# Altium schematic sheet MY_beamControl_R_组件电源分配.SchDoc
size A3
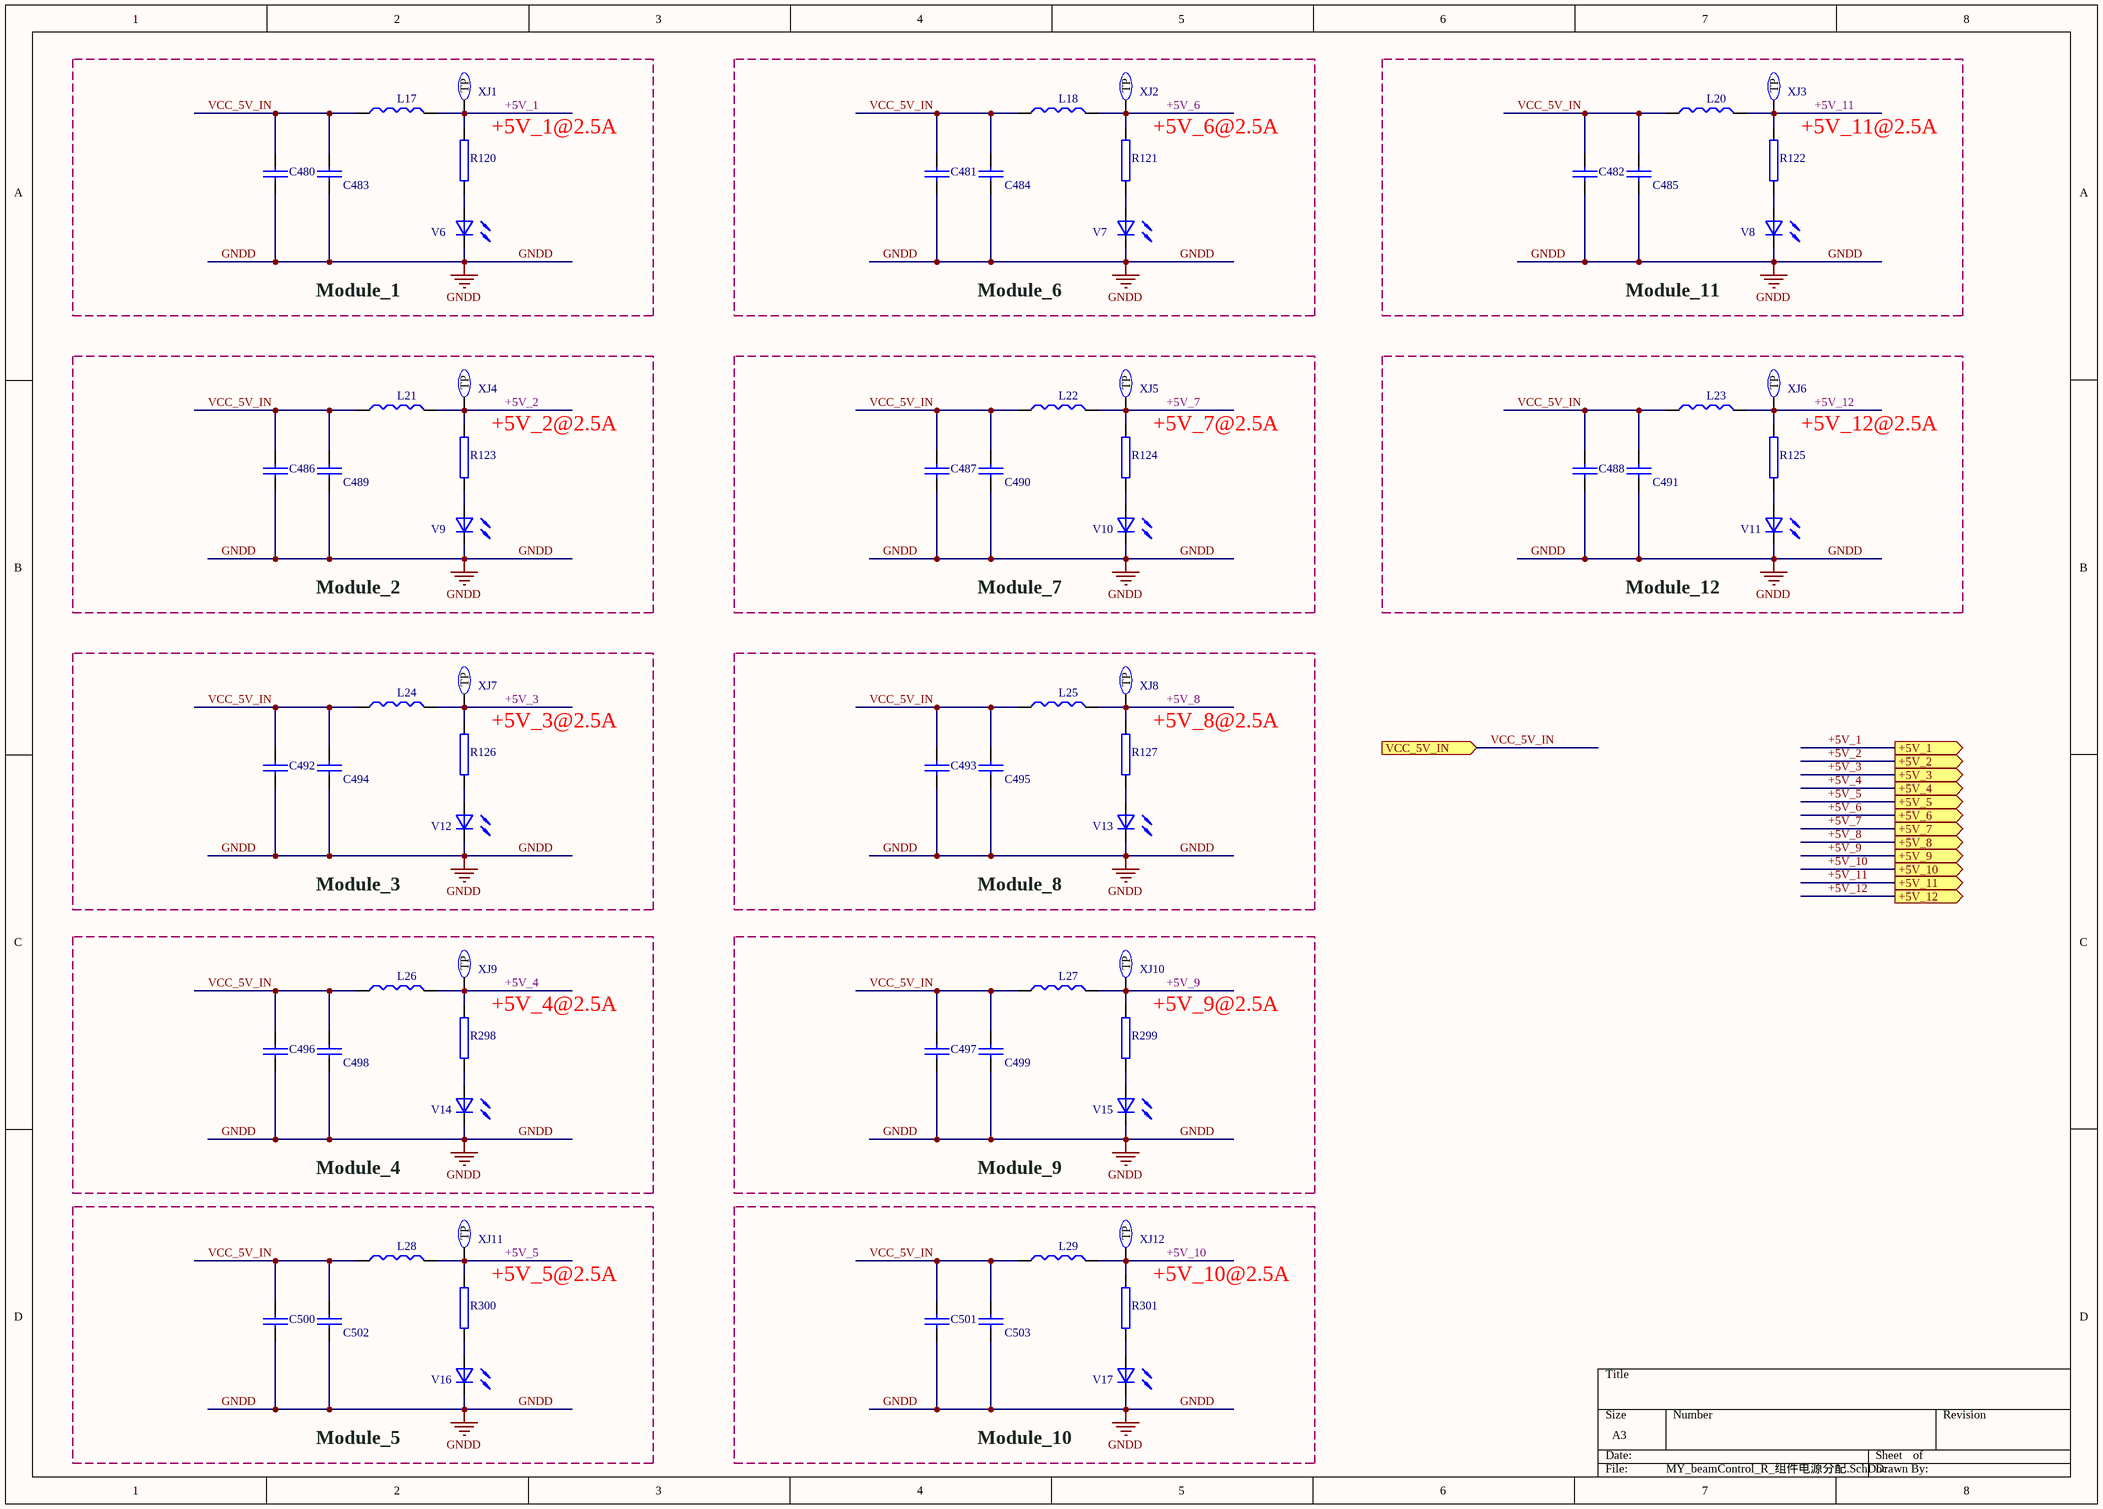
[diagram p0: MY_beamControl_R_组件电源分配.SchDoc]

## Parts
C480  C0805-4.7uF/16V  [0805]  (value not drawn)
C481  C0805-4.7uF/16V  [0805]  (value not drawn)
C482  C0805-4.7uF/16V  [0805]  (value not drawn)
C483  CT41-0402-2X1-16V-104(0.1μF)  [c0402]  (value not drawn)
C484  CT41-0402-2X1-16V-104(0.1μF)  [c0402]  (value not drawn)
C485  CT41-0402-2X1-16V-104(0.1μF)  [c0402]  (value not drawn)
C486  C0805-4.7uF/16V  [0805]  (value not drawn)
C487  C0805-4.7uF/16V  [0805]  (value not drawn)
C488  C0805-4.7uF/16V  [C0805]  (value not drawn)
C489  CT41-0402-2X1-16V-104(0.1μF)  [c0402]  (value not drawn)
C490  CT41-0402-2X1-16V-104(0.1μF)  [c0402]  (value not drawn)
C491  CT41-0402-2X1-16V-104(0.1μF)  [c0402]  (value not drawn)
C492  C0805-4.7uF/16V  [0805]  (value not drawn)
C493  C0805-4.7uF/16V  [0805]  (value not drawn)
C494  CT41-0402-2X1-16V-104(0.1μF)  [c0402]  (value not drawn)
C495  CT41-0402-2X1-16V-104(0.1μF)  [c0402]  (value not drawn)
C496  C0805-4.7uF/16V  [0805]  (value not drawn)
C497  C0805-4.7uF/16V  [0805]  (value not drawn)
C498  CT41-0402-2X1-16V-104(0.1μF)  [c0402]  (value not drawn)
C499  CT41-0402-2X1-16V-104(0.1μF)  [c0402]  (value not drawn)
C500  C0805-4.7uF/16V  [0805]  (value not drawn)
C501  C0805-4.7uF/16V  [0805]  (value not drawn)
C502  CT41-0402-2X1-16V-104(0.1μF)  [c0402]  (value not drawn)
C503  CT41-0402-2X1-16V-104(0.1μF)  [c0402]  (value not drawn)
L17  MPZ2012S101A  [R0805]  (value not drawn)
L18  MPZ2012S101A  [R0805]  (value not drawn)
L20  MPZ2012S101A  [R0805]  (value not drawn)
L21  MPZ2012S101A  [R0805]  (value not drawn)
L22  MPZ2012S101A  [R0805]  (value not drawn)
L23  MPZ2012S101A  [R0805]  (value not drawn)
L24  MPZ2012S101A  [R0805]  (value not drawn)
L25  MPZ2012S101A  [R0805]  (value not drawn)
L26  MPZ2012S101A  [R0805]  (value not drawn)
L27  MPZ2012S101A  [R0805]  (value not drawn)
L28  MPZ2012S101A  [R0805]  (value not drawn)
L29  MPZ2012S101A  [R0805]  (value not drawn)
R120  0805-512(5.1K)  [0805]  (value not drawn)
R121  0805-512(5.1K)  [0805]  (value not drawn)
R122  0805-512(5.1K)  [0805]  (value not drawn)
R123  0805-512(5.1K)  [0805]  (value not drawn)
R124  0805-512(5.1K)  [0805]  (value not drawn)
R125  0805-512(5.1K)  [0805]  (value not drawn)
R126  0805-512(5.1K)  [0805]  (value not drawn)
R127  0805-512(5.1K)  [0805]  (value not drawn)
R298  0805-512(5.1K)  [0805]  (value not drawn)
R299  0805-512(5.1K)  [0805]  (value not drawn)
R300  0805-512(5.1K)  [0805]  (value not drawn)
R301  0805-512(5.1K)  [0805]  (value not drawn)
V6  LED0603-GREEN  [LED-R0603]  (value not drawn)
V7  LED0603-GREEN  [LED-R0603]  (value not drawn)
V8  LED0603-GREEN  [LED-R0603]  (value not drawn)
V9  LED0603-GREEN  [LED-R0603]  (value not drawn)
V10  LED0603-GREEN  [LED-R0603]  (value not drawn)
V11  LED0603-GREEN  [LED-R0603]  (value not drawn)
V12  LED0603-GREEN  [LED-R0603]  (value not drawn)
V13  LED0603-GREEN  [LED-R0603]  (value not drawn)
V14  LED0603-GREEN  [LED-R0603]  (value not drawn)
V15  LED0603-GREEN  [LED-R0603]  (value not drawn)
V16  LED0603-GREEN  [LED-R0603]  (value not drawn)
V17  LED0603-GREEN  [LED-R0603]  (value not drawn)
XJ1  Test Point  [TP3]  (value not drawn)
XJ2  Test Point  [TP3]  (value not drawn)
XJ3  Test Point  [TP3]  (value not drawn)
XJ4  Test Point  [TP3]  (value not drawn)
XJ5  Test Point  [TP3]  (value not drawn)
XJ6  Test Point  [TP3]  (value not drawn)
XJ7  Test Point  [TP3]  (value not drawn)
XJ8  Test Point  [TP3]  (value not drawn)
XJ9  Test Point  [TP3]  (value not drawn)
XJ10  Test Point  [TP3]  (value not drawn)
XJ11  Test Point  [TP3]  (value not drawn)
XJ12  Test Point  [TP3]  (value not drawn)

## Blocks framed on the sheet
+5V_1@2.5A: C480 C483 L17 R120 V6 XJ1
+5V_6@2.5A: C481 C484 L18 R121 V7 XJ2
+5V_11@2.5A: C482 C485 L20 R122 V8 XJ3
+5V_2@2.5A: C486 C489 L21 R123 V9 XJ4
+5V_7@2.5A: C487 C490 L22 R124 V10 XJ5
+5V_12@2.5A: C488 C491 L23 R125 V11 XJ6
+5V_3@2.5A: C492 C494 L24 R126 V12 XJ7
+5V_8@2.5A: C493 C495 L25 R127 V13 XJ8
+5V_4@2.5A: C496 C498 L26 R298 V14 XJ9
+5V_9@2.5A: C497 C499 L27 R299 V15 XJ10
+5V_5@2.5A: C500 C502 L28 R300 V16 XJ11
+5V_10@2.5A: C501 C503 L29 R301 V17 XJ12

## Ports
+5V_1 (out), +5V_2 (out), +5V_3 (out), +5V_4 (out), +5V_5 (out), +5V_6 (out), +5V_7 (out), +5V_8 (out), +5V_9 (out), +5V_10 (out), +5V_11 (out), +5V_12 (out), VCC_5V_IN (in)

## Nets
GNDD: C480.1 C481.1 C482.1 C483.2 C484.2 C485.2 C486.1 C487.1 C488.1 C489.2 C490.2 C491.2 C492.1 C493.1 C494.2 C495.2 C496.1 C497.1 C498.2 C499.2 C500.1 C501.1 C502.2 C503.2 V6.2(K) V7.2(K) V8.2(K) V9.2(K) V10.2(K) V11.2(K) V12.2(K) V13.2(K) V14.2(K) V15.2(K) V16.2(K) V17.2(K)
+5V_1: L17.2 R120.2 XJ1.1(TP) ; port +5V_1
+5V_2: L21.2 R123.2 XJ4.1(TP) ; port +5V_2
+5V_3: L24.2 R126.2 XJ7.1(TP) ; port +5V_3
+5V_4: L26.2 R298.2 XJ9.1(TP) ; port +5V_4
+5V_5: L28.2 R300.2 XJ11.1(TP) ; port +5V_5
+5V_6: L18.2 R121.2 XJ2.1(TP) ; port +5V_6
+5V_7: L22.2 R124.2 XJ5.1(TP) ; port +5V_7
+5V_8: L25.2 R127.2 XJ8.1(TP) ; port +5V_8
+5V_9: L27.2 R299.2 XJ10.1(TP) ; port +5V_9
+5V_10: L29.2 R301.2 XJ12.1(TP) ; port +5V_10
+5V_11: L20.2 R122.2 XJ3.1(TP) ; port +5V_11
+5V_12: L23.2 R125.2 XJ6.1(TP) ; port +5V_12
VCC_5V_IN: C480.2 C481.2 C482.2 C483.1 C484.1 C485.1 C486.2 C487.2 C488.2 C489.1 C490.1 C491.1 C492.2 C493.2 C494.1 C495.1 C496.2 C497.2 C498.1 C499.1 C500.2 C501.2 C502.1 C503.1 L17.1 L18.1 L20.1 L21.1 L22.1 L23.1 L24.1 L25.1 L26.1 L27.1 L28.1 L29.1 ; port VCC_5V_IN
NetR120_1: R120.1 V6.1(A)
NetR121_1: R121.1 V7.1(A)
NetR122_1: R122.1 V8.1(A)
NetR123_1: R123.1 V9.1(A)
NetR124_1: R124.1 V10.1(A)
NetR125_1: R125.1 V11.1(A)
NetR126_1: R126.1 V12.1(A)
NetR127_1: R127.1 V13.1(A)
NetR298_1: R298.1 V14.1(A)
NetR299_1: R299.1 V15.1(A)
NetR300_1: R300.1 V16.1(A)
NetR301_1: R301.1 V17.1(A)

## Notes on the sheet
- Module_1
- Module_6
- Module_11
- Module_2
- Module_7
- Module_12
- Module_3
- Module_8
- Module_4
- Module_9
- Module_5
- Module_10

## Library data of the parts
C480-C482 C486-C488 C492 C493 C496 C497 C500 C501 = C
C483-C485 C489-C491 C494 C495 C498 C499 C502 C503 = C_2
L17 L18 L20-L29 = ProE2A0.TMP_UnNamed_1
R120-R127 R298-R301 = RES2
V6-V17 = LED: Part Field 1: 3
XJ1-XJ12 = TP: 测试点